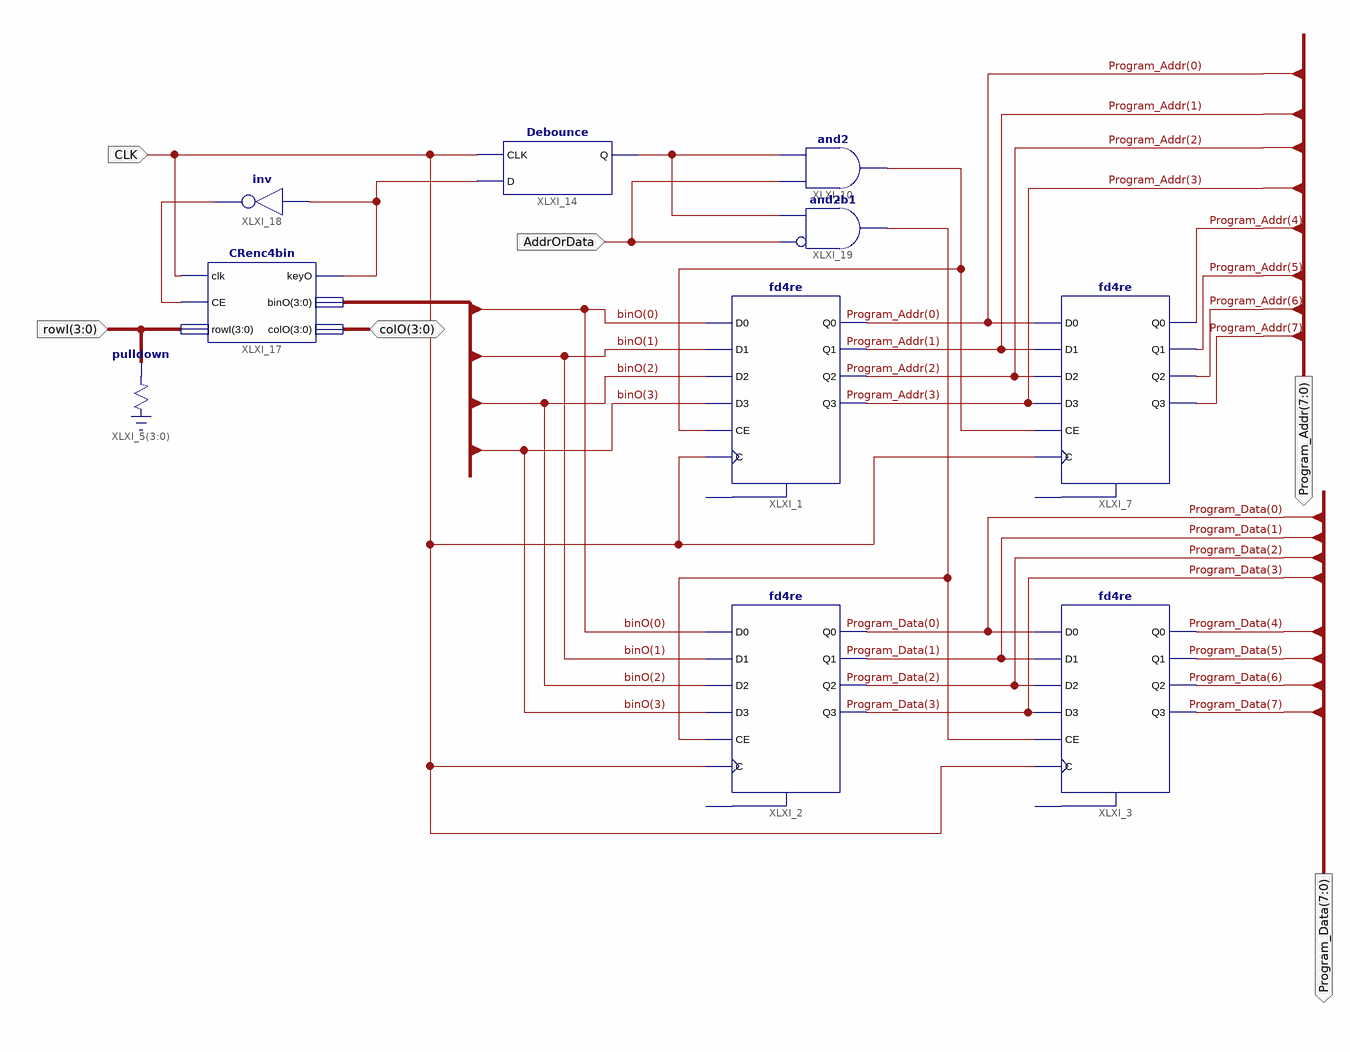
[diagram p0: schematic sheet 1]
// Xilinx ISE schematic Program_Mode.sch (spartan3e) as structural Verilog: 10 symbols, 6 ports
module Program_Mode (
  input  [3:0] rowI,
  input  AddrOrData,
  input  CLK,
  inout  [3:0] colO,
  output [7:0] Program_Addr,
  output [7:0] Program_Data
);

  wire XLXN_9, XLXN_21, XLXN_23, XLXN_30, XLXN_31;
  wire [3:0] binO;

  fd4re XLXI_1 (
    .C(CLK), .CE(XLXN_9), .D0(binO[0]), .D1(binO[1]), .D2(binO[2]), .D3(binO[3]), .Q0(Program_Addr[0]),
    .Q1(Program_Addr[1]), .Q2(Program_Addr[2]), .Q3(Program_Addr[3]));  // open: R
  fd4re XLXI_2 (
    .C(CLK), .CE(XLXN_23), .D0(binO[0]), .D1(binO[1]), .D2(binO[2]), .D3(binO[3]), .Q0(Program_Data[0]),
    .Q1(Program_Data[1]), .Q2(Program_Data[2]), .Q3(Program_Data[3]));  // open: R
  fd4re XLXI_3 (
    .C(CLK), .CE(XLXN_23), .D0(Program_Data[0]), .D1(Program_Data[1]), .D2(Program_Data[2]),
    .D3(Program_Data[3]), .Q0(Program_Data[4]), .Q1(Program_Data[5]), .Q2(Program_Data[6]),
    .Q3(Program_Data[7]));  // open: R
  fd4re XLXI_7 (
    .C(CLK), .CE(XLXN_9), .D0(Program_Addr[0]), .D1(Program_Addr[1]), .D2(Program_Addr[2]),
    .D3(Program_Addr[3]), .Q0(Program_Addr[4]), .Q1(Program_Addr[5]), .Q2(Program_Addr[6]),
    .Q3(Program_Addr[7]));  // open: R
  not XLXI_18 (XLXN_31, XLXN_30);
  CRenc4bin XLXI_17 (.clk(CLK), .CE(XLXN_31), .rowI(rowI), .keyO(XLXN_30), .binO(binO), .colO(colO));
  \pulldown  XLXI_5[3:0] (.O(rowI));
  and XLXI_10 (XLXN_9, AddrOrData, XLXN_21);
  Debounce XLXI_14 (.CLK(CLK), .D(XLXN_30), .Q(XLXN_21));
  and XLXI_19 (XLXN_23, ~AddrOrData, XLXN_21);  // and2b1
endmodule
